# EAGLE design RJ11-4-PIN to Header (EAGLE 9.5.2)
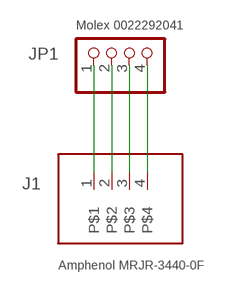
[diagram p0: schematic, sheet 1]

## Parts
J1  Amphenol MRJR-3440-0F  RJ11-4-PIN  [RJ11-4-PIN]
JP1  Molex 0022292041  PINHD-1X4MOLEX-04-VERT  [MOLEX-04-VERT]

## Nets
N$1: J1.1 JP1.1
N$2: J1.2 JP1.2
N$3: J1.3 JP1.3
N$4: J1.4 JP1.4

## Library data of the parts
J1 = AUmlib:RJ11-4-PIN
JP1 = AUmlib:PINHD-1X4: PIN HEADER

## Board
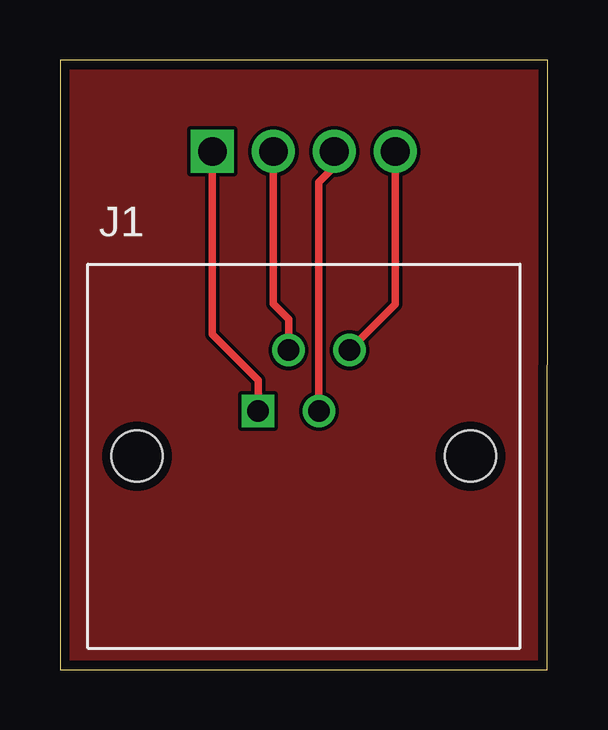
[diagram p1: board, top side]
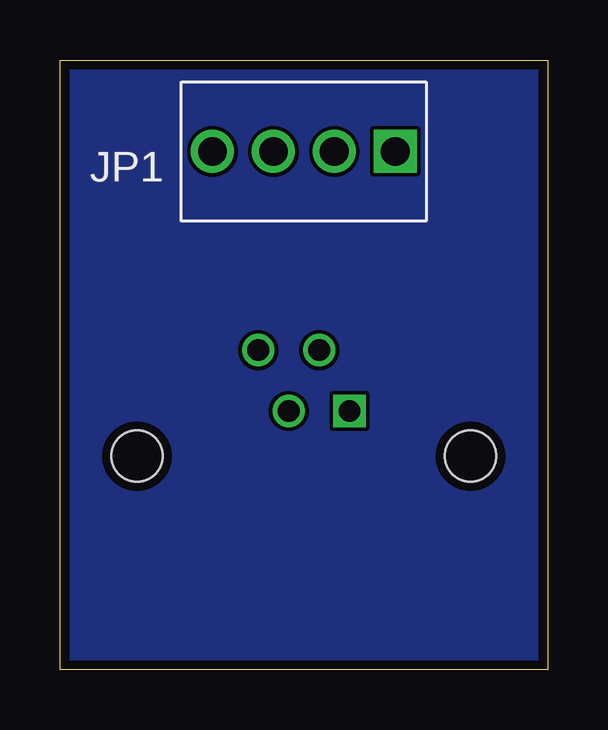
[diagram p2: board, bottom side, seen from below]

Size 20.32 x 25.4 mm. Coordinates in mm from the lower left corner, seen from the top.
Outline: 0,0 20.3,0 20.32,25.4 0,25.4 0,0
Copper layers (1*16): Top 0.035559375mm / dielectric 1.6mm / Bottom 0.035559375mm
Design rules "oshpark-2layer": minimum track width 6mil, minimum drill 10mil, track to track 6mil, track to pad 6mil, pad to pad 6mil, via to via 6mil, smd to smd 6mil, copper to edge 15mil, drill to drill 6mil, minimum pad ring 5mil, minimum via ring 5mil, stop-mask expansion 2.5mil, vias tented up to drill 0mil, thermal gap 10mil

### Footprints (pad centres in the part's own frame; a part is rotated, then mirrored left to right if it is on the bottom)
RJ11-4-PIN = drill 0.9 square: 1 -1.91,1.88 | drill 0.9: 2 -0.64,4.42; 3 0.63,1.88; 4 1.9,4.42 | hole 2.13: -6.95,0; 6.95,0
MOLEX-04-VERT = drill 1.194 square: 1 -3.81,0 | drill 1.194: 2 -1.27,0; 3 1.27,0; 4 3.81,0

### Placement (x,y rotation side)
J1  10.16,8.89 0 top
JP1  10.16,21.59 180 bottom

### Tracks (layer width: path | path; a pad name or v marks a point on that pad's centre or on a via)
+5V
  pour Bottom: 0,0 20.32,0 20.32,25.4 0,25.4
GND
  pour Top: 0,0 20.32,0 20.32,25.4 0,25.4
N$1
  Top 0.305: JP1.1 6.35,13.97 8.26,12.06 J1.1
N$2
  Top 0.305: JP1.2 8.89,15.24 9.53,14.61 J1.2
N$3
  Top 0.305: JP1.3 11.43,20.95 10.79,20.32 J1.3
N$4
  Top 0.305: J1.4 13.97,15.22 JP1.4